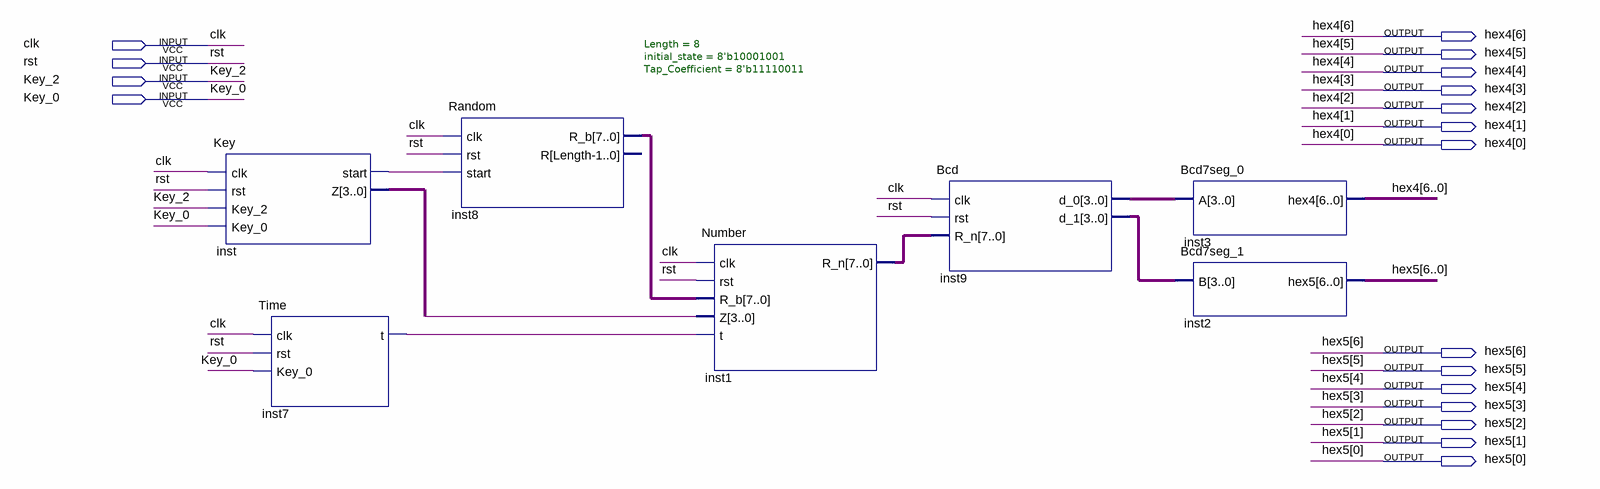
[diagram p0: schematic sheet]
// Quartus schematic Block1.bdf as structural Verilog: 7 symbols, 18 pins
module Block1 (
  input  clk,
  input  rst,
  input  Key_2,
  input  Key_0,
  output [6:0] hex4,
  output [6:0] hex5
);

  wire inst7_t, inst_start, undriven;
  wire [3:0] inst9_d_0, inst9_d_1, inst_z;
  wire [7:0] inst1_r_n, inst8_r_b;

  Key inst (.clk(clk), .rst(rst), .Key_2(Key_2), .Key_0(Key_0), .start(inst_start), .Z(inst_z));
  Time inst7 (.clk(clk), .rst(rst), .Key_0(Key_0), .t(inst7_t));
  Random #(.Length(8), .initial_state(8'b10001001), .Tap_Coefficient(8'b11110011)) inst8 (
    .clk(clk), .rst(rst), .start(inst_start), .R_b(inst8_r_b));  // open: R
  Number inst1 (.clk(clk), .rst(rst), .R_b(inst8_r_b), .Z({4{undriven}}), .t(inst7_t), .R_n(inst1_r_n));
  Bcd inst9 (.clk(clk), .rst(rst), .R_n(inst1_r_n), .d_0(inst9_d_0), .d_1(inst9_d_1));
  Bcd7seg_0 inst3 (.A(inst9_d_0), .hex4(hex4));
  Bcd7seg_1 inst2 (.B(inst9_d_1), .hex5(hex5));
endmodule
